# EAGLE schematic final (EAGLE 9.6.1)
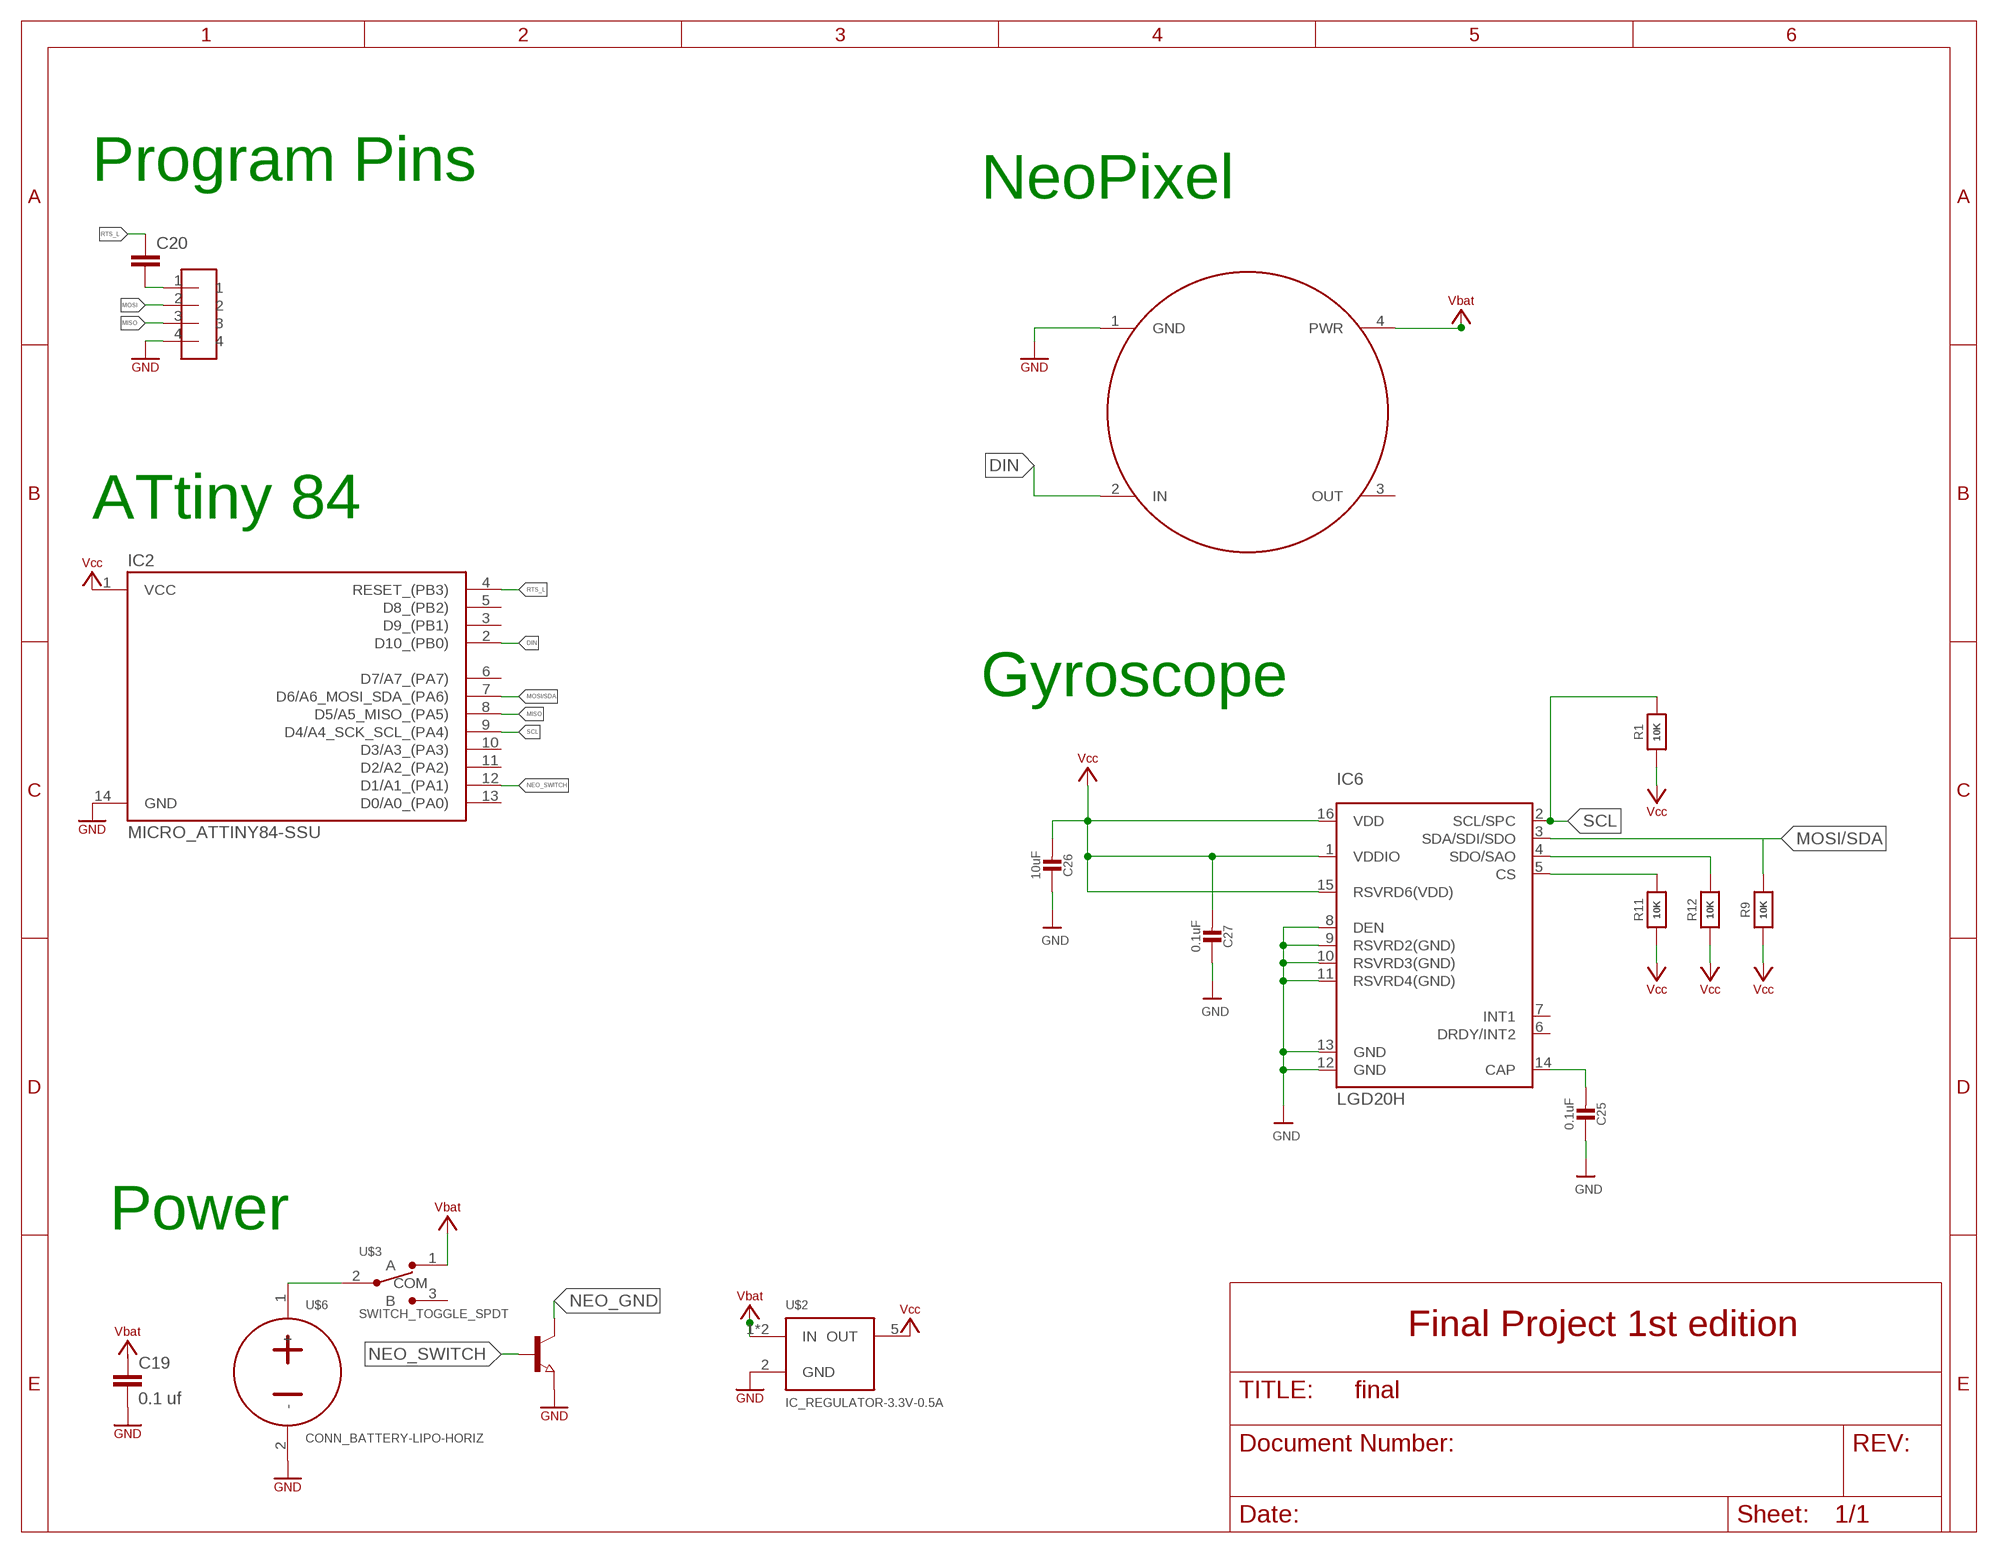
[diagram p0: schematic, sheet 1]

## Parts
C19  0.1 uf  COMPONENT_CAP-0805  [0805]
C20  COMPONENT_CAP-0805  [0805]
C25  0.1uF  CAP_CERAMIC0805-NOOUTLINE  [0805-NO]
C26  10uF  CAP_CERAMIC0805-NOOUTLINE  [0805-NO]
C27  0.1uF  CAP_CERAMIC0805-NOOUTLINE  [0805-NO]
IC2  MICRO_ATTINY84-SSU  [SOIC14]
IC6  LGD20H  GYRO_L3GD20H  [L3GD20H_LGA16L]
R1  10K  RESISTOR_0805MP  [_0805MP]
R9  10K  RESISTOR0805_NOOUTLINE  [0805-NO]
R11  10K  RESISTOR_0805MP  [_0805MP]
R12  10K  RESISTOR0805_NOOUTLINE  [0805-NO]
U$1  NEOPIX_12  [NEOPIX_12]
U$2  IC_REGULATOR-3.3V-0.5A  [SOT23-5]
U$3  SWITCH_TOGGLE_SPDT  [SS312SAH4]
U$4  COMPONENT_TRANSISTOR_NPN  [SOT23]
U$6  CONN_BATTERY-LIPO-HORIZ  [JST-PH-2-SMT-RA]
U$7  HEADER-4-DIP  [HEADER-4-DIP]

## Nets
CS_3.3V: IC6.5(CS) R11.2
DIN: IC2.2(D10_(PB0)) U$1.2(IN)
GND: C19.2 C25.1 C26.1 C27.1 IC2.14(GND) IC6.8(DEN) IC6.9(RSVRD2(GND)) IC6.10(RSVRD3(GND)) IC6.11(RSVRD4(GND)) IC6.12(GND) IC6.13(GND) U$1.1(GND) U$2.2(GND) U$4.2(E) U$6.2(-) U$7.4 ; supply symbol labelled SYMBOL_GND
MISO: IC2.8(D5/A5_MISO_(PA5))
MOSI/SDA: IC2.7(D6/A6_MOSI_SDA_(PA6)) IC6.3(SDA/SDI/SDO) R9.2
N$1: U$3.2(COM) U$6.1(+)
N$29: U$7.2
N$30: U$7.3
N$32: C25.2 IC6.14(CAP)
NEO_GND: U$4.3(C)
NEO_SWITCH: IC2.12(D1/A1_(PA1)) U$4.1(B)
RTS1: C20.2 U$7.1
RTS_L: C20.1 IC2.4(RESET_(PB3))
SCL: IC2.9(D4/A4_SCK_SCL_(PA4)) IC6.2(SCL/SPC) R1.2
SDO/SAO: IC6.4(SDO/SAO) R12.2
VBAT: U$1.4(PWR) U$2.1(IN) U$2.3(IN) U$3.1(A) ; supply symbol labelled SYMBOL_VBAT
VCC: C26.2 C27.2 IC2.1(VCC) IC6.1(VDDIO) IC6.15(RSVRD6(VDD)) IC6.16(VDD) R1.1 R9.1 R11.1 R12.1 U$2.5(OUT) ; supply symbol labelled SYMBOL_VCC
Unconnected: C19.1 IC2.3(D9_(PB1)) IC2.5(D8_(PB2)) IC2.6(D7/A7_(PA7)) IC2.10(D3/A3_(PA3)) IC2.11(D2/A2_(PA2)) IC2.13(D0/A0_(PA0)) IC6.6(DRDY/INT2) IC6.7(INT1) U$1.3(OUT) U$3.3(B)

## Notes on the sheet
- Program Pins | NeoPixel
- ATtiny 84
- Gyroscope
- Power
- Final Project 1st edition

## Library data of the parts
C19 C20 = homemade-hardware:COMPONENT_CAP: Capacitor Standard 0603 ceramic capacitor, and 0.1" leaded capacitor.
C25-C27 = microbuilder:CAP_CERAMIC: Ceramic Capacitors For new designs, use the packages preceded by an '_' character since they are more reliable: The following footprints should be used on most boards: _0402 - Standard footprint for regular board layouts _0603 - Standard footprint for regular board layouts _0805 - Standard footprint for regular board layouts _1206 - Standard footprint for regular board layouts For extremely tight-pitch boards where space is at a premium, the following 'micro-pitch' footprints can be used (smaller pads, no silkscreen outline, etc.): _0402MP - Micro-pitch footprint for very dense/compact boards _0603MP - Micro-pitch footprint for very dense/compact boards _0805MP - Micro-pitch footprint for very dense/compact boards _1206MP - Micro-pitch footprint for very dense/compact boards
IC2 = homemade-hardware:MICRO_ATTINY84
IC6 = microbuilder:GYRO_L3GD20H: L3GD20H - 3 Axis Gyro
R1 R9 R11 R12 = microbuilder:RESISTOR: Resistors For new designs, use the packages preceded by an '_' character since they are more reliable: The following footprints should be used on most boards: _0402 - Standard footprint for regular board layouts _0603 - Standard footprint for regular board layouts _0805 - Standard footprint for regular board layouts _1206 - Standard footprint for regular board layouts For extremely tight-pitch boards where space is at a premium, the following 'micro-pitch' footprints can be used (smaller pads, no silkscreen outline, etc.): _0402MP - Micro-pitch footprint for very dense/compact boards _0603MP - Micro-pitch footprint for very dense/compact boards _0805MP - Micro-pitch footprint for very dense/compact boards _1206MP - Micro-pitch footprint for very dense/compact boards
U$1 = SimNeoPix:NEOPIX_12
U$2 = homemade-hardware:IC_REGULATOR: SPX3819M5-L-5-0/TR <https://www.digikey.com/product-detail/en/maxlinear-inc/SPX3819M5-L-5-0-TR/1016-1874-6-ND/3586704>: 5.0V/0.5A SMD Linear Regulator SPX3819M5-L-3-3/TR <https://www.digikey.com/product-detail/en/maxlinear-inc/SPX3819M5-L-3-3-TR/1016-1873-6-ND/3586703>: 3.3V/0.5A SMD Linear Regulator; PN: SPX3819M5-L-3-3/TR
U$3 = homemade-hardware:SWITCH_TOGGLE_SPDT; HEIGHT: 2.9; PN: SS312SAH4
U$4 = homemade-hardware:COMPONENT_TRANSISTOR_NPN: BSS806NH6327XTSA1 <https://www.digikey.com/product-detail/en/infineon-technologies/BSS806NH6327XTSA1/BSS806NH6327XTSA1DKR-ND/3196843>: NPN Moseft Transistor - 20V 2.3A; PN: BSS806NH6327XTSA1
U$6 = homemade-hardware:CONN_BATTERY
U$7 = homemade-hardware:HEADER-4: NPTC081KFXC-RC <https://www.digikey.com/product-detail/en/sullins-connector-solutions/NPTC081KFXC-RC/S5600-ND/776058>: Vertical Female SMD Headers TSM-110-01-T-SV <https://www.digikey.com/product-detail/en/samtec-inc/TSM-110-01-T-SV/SAM12267-ND/6691889>: Vertical Male SMD Headers M20-8890845 <https://www.digikey.com/products/en?keywords=952-3236-ND>: Horizontal Male SMD Headers M20-7910842R <https://www.digikey.com/product-detail/en/harwin-inc/M20-7910842R/952-3200-6-ND/6559341>: Horizontal Female SMD Headers